# Altium schematic sheet pfc.SchDoc
size A4; SheetNumber: 1; SheetTotal: 4
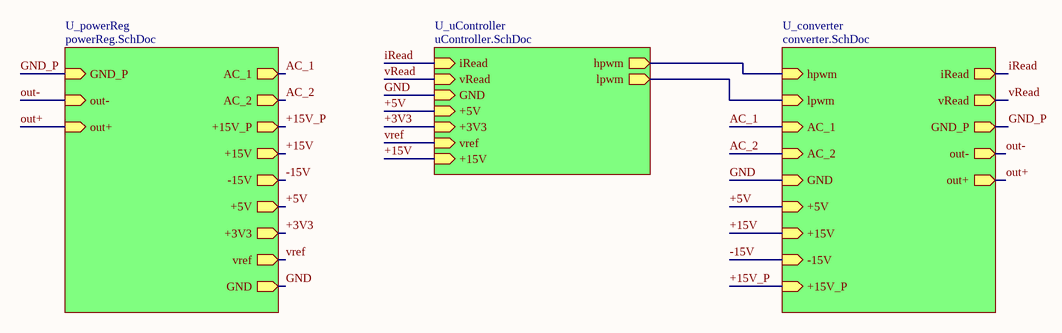
[diagram p0: pfc.SchDoc]

## Sub-sheets
U_converter = converter.SchDoc: iRead (out), vRead (out), hpwm (in), lpwm (in), AC_1 (in), AC_2 (in), GND_P (out), out- (out), out+ (out), GND (in), +5V (in), +15V (in), -15V (in), +15V_P (in)
U_powerReg = powerReg.SchDoc: AC_1 (out), AC_2 (out), +15V_P (out), +15V (out), -15V (out), +5V (out), +3V3 (out), vref (out), GND_P (in), out- (in), out+ (in), GND (out)
U_uController = uController.SchDoc: iRead (in), vRead (in), hpwm (out), lpwm (out), GND (in), +5V (in), +3V3 (in), vref (in), +15V (in)

## Nets
+3V3: sheet U_powerReg/+3V3, sheet U_uController/+3V3
+5V: sheet U_converter/+5V, sheet U_powerReg/+5V, sheet U_uController/+5V
+15V: sheet U_converter/+15V, sheet U_powerReg/+15V, sheet U_uController/+15V
+15V_P: sheet U_converter/+15V_P, sheet U_powerReg/+15V_P
-15V: sheet U_converter/-15V, sheet U_powerReg/-15V
AC_1: sheet U_converter/AC_1, sheet U_powerReg/AC_1
AC_2: sheet U_converter/AC_2, sheet U_powerReg/AC_2
GND: sheet U_converter/GND, sheet U_powerReg/GND, sheet U_uController/GND
GND_P: sheet U_converter/GND_P, sheet U_powerReg/GND_P
iRead: sheet U_converter/iRead, sheet U_uController/iRead
out+: sheet U_converter/out+, sheet U_powerReg/out+
out-: sheet U_converter/out-, sheet U_powerReg/out-
vRead: sheet U_converter/vRead, sheet U_uController/vRead
vref: sheet U_powerReg/vref, sheet U_uController/vref
(unnamed): sheet U_converter/hpwm, sheet U_uController/hpwm
(unnamed): sheet U_converter/lpwm, sheet U_uController/lpwm